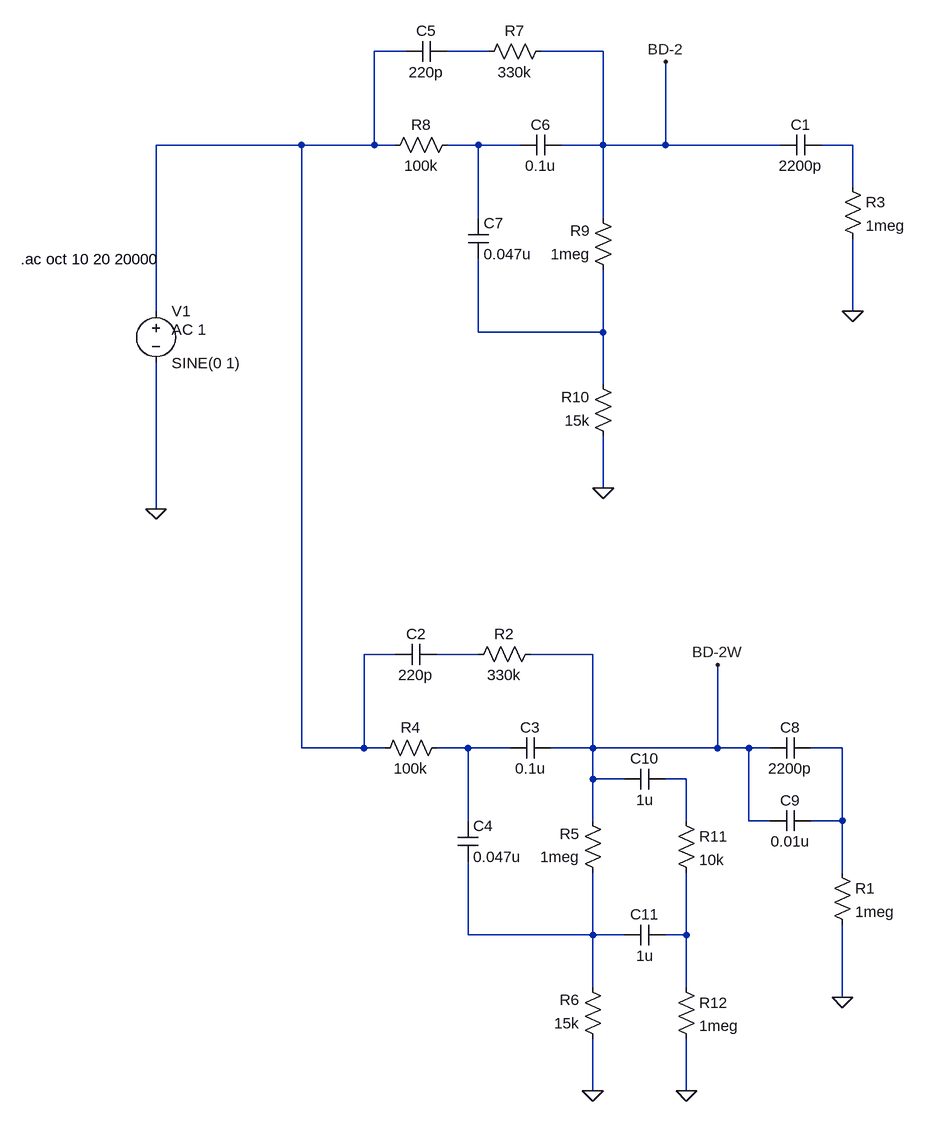
[diagram p0: schematic BD-2_BD-2W_PreClip.asc]
BD-2_BD-2W_PreClip.asc, the LTspice schematic file:
Version 4
SHEET 1 1244 1108
WIRE 464 -512 416 -512
WIRE 592 -512 528 -512
WIRE 768 -512 672 -512
WIRE 304 -368 80 -368
WIRE 416 -368 416 -512
WIRE 416 -368 304 -368
WIRE 448 -368 416 -368
WIRE 576 -368 528 -368
WIRE 640 -368 576 -368
WIRE 768 -368 768 -512
WIRE 768 -368 704 -368
WIRE 864 -368 864 -496
WIRE 864 -368 768 -368
WIRE 1040 -368 864 -368
WIRE 1152 -368 1104 -368
WIRE 1152 -304 1152 -368
WIRE 576 -256 576 -368
WIRE 768 -256 768 -368
WIRE 80 -112 80 -368
WIRE 1152 -112 1152 -224
WIRE 576 -80 576 -192
WIRE 768 -80 768 -176
WIRE 768 -80 576 -80
WIRE 768 0 768 -80
WIRE 768 160 768 80
WIRE 80 192 80 -32
WIRE 448 416 400 416
WIRE 576 416 512 416
WIRE 752 416 656 416
WIRE 304 560 304 -368
WIRE 400 560 400 416
WIRE 400 560 304 560
WIRE 432 560 400 560
WIRE 560 560 512 560
WIRE 624 560 560 560
WIRE 752 560 752 416
WIRE 752 560 688 560
WIRE 944 560 944 432
WIRE 944 560 752 560
WIRE 992 560 944 560
WIRE 1024 560 992 560
WIRE 1136 560 1088 560
WIRE 752 608 752 560
WIRE 800 608 752 608
WIRE 896 608 864 608
WIRE 560 672 560 560
WIRE 752 672 752 608
WIRE 896 672 896 608
WIRE 992 672 992 560
WIRE 1024 672 992 672
WIRE 1136 672 1136 560
WIRE 1136 672 1088 672
WIRE 1136 752 1136 672
WIRE 560 848 560 736
WIRE 752 848 752 752
WIRE 752 848 560 848
WIRE 800 848 752 848
WIRE 896 848 896 752
WIRE 896 848 864 848
WIRE 752 928 752 848
WIRE 896 928 896 848
WIRE 1136 944 1136 832
WIRE 752 1088 752 1008
WIRE 896 1088 896 1008
FLAG 80 192 0
FLAG 1152 -112 0
FLAG 768 160 0
FLAG 864 -496 BD-2
FLAG 1136 944 0
FLAG 752 1088 0
FLAG 944 432 BD-2W
FLAG 896 1088 0
SYMBOL res 1136 -320 R0
SYMATTR InstName R3
SYMATTR Value 1meg
SYMBOL voltage 80 -128 R0
WINDOW 123 24 44 Left 2
WINDOW 39 0 0 Left 2
SYMATTR Value2 AC 1
SYMATTR InstName V1
SYMATTR Value SINE(0 1)
SYMBOL cap 528 -528 R90
WINDOW 0 0 32 VBottom 2
WINDOW 3 32 32 VTop 2
SYMATTR InstName C5
SYMATTR Value 220p
SYMBOL cap 704 -384 R90
WINDOW 0 0 32 VBottom 2
WINDOW 3 32 32 VTop 2
SYMATTR InstName C6
SYMATTR Value 0.1u
SYMBOL res 688 -528 R90
WINDOW 0 0 56 VBottom 2
WINDOW 3 32 56 VTop 2
SYMATTR InstName R7
SYMATTR Value 330k
SYMBOL res 544 -384 R90
WINDOW 0 0 56 VBottom 2
WINDOW 3 32 56 VTop 2
SYMATTR InstName R8
SYMATTR Value 100k
SYMBOL res 784 -160 R180
WINDOW 0 36 76 Left 2
WINDOW 3 36 40 Left 2
SYMATTR InstName R9
SYMATTR Value 1meg
SYMBOL res 784 96 R180
WINDOW 0 36 76 Left 2
WINDOW 3 36 40 Left 2
SYMATTR InstName R10
SYMATTR Value 15k
SYMBOL cap 560 -256 R0
SYMATTR InstName C7
SYMATTR Value 0.047u
SYMBOL cap 1104 -384 R90
WINDOW 0 0 32 VBottom 2
WINDOW 3 32 32 VTop 2
SYMATTR InstName C1
SYMATTR Value 2200p
SYMBOL res 1120 736 R0
SYMATTR InstName R1
SYMATTR Value 1meg
SYMBOL cap 512 400 R90
WINDOW 0 0 32 VBottom 2
WINDOW 3 32 32 VTop 2
SYMATTR InstName C2
SYMATTR Value 220p
SYMBOL cap 688 544 R90
WINDOW 0 0 32 VBottom 2
WINDOW 3 32 32 VTop 2
SYMATTR InstName C3
SYMATTR Value 0.1u
SYMBOL res 672 400 R90
WINDOW 0 0 56 VBottom 2
WINDOW 3 32 56 VTop 2
SYMATTR InstName R2
SYMATTR Value 330k
SYMBOL res 528 544 R90
WINDOW 0 0 56 VBottom 2
WINDOW 3 32 56 VTop 2
SYMATTR InstName R4
SYMATTR Value 100k
SYMBOL res 768 768 R180
WINDOW 0 36 76 Left 2
WINDOW 3 36 40 Left 2
SYMATTR InstName R5
SYMATTR Value 1meg
SYMBOL res 768 1024 R180
WINDOW 0 36 76 Left 2
WINDOW 3 36 40 Left 2
SYMATTR InstName R6
SYMATTR Value 15k
SYMBOL cap 544 672 R0
SYMATTR InstName C4
SYMATTR Value 0.047u
SYMBOL cap 1088 544 R90
WINDOW 0 0 32 VBottom 2
WINDOW 3 32 32 VTop 2
SYMATTR InstName C8
SYMATTR Value 2200p
SYMBOL cap 1088 656 R90
WINDOW 0 0 32 VBottom 2
WINDOW 3 32 32 VTop 2
SYMATTR InstName C9
SYMATTR Value 0.01u
SYMBOL res 880 656 R0
SYMATTR InstName R11
SYMATTR Value 10k
SYMBOL cap 864 592 R90
WINDOW 0 0 32 VBottom 2
WINDOW 3 32 32 VTop 2
SYMATTR InstName C10
SYMATTR Value 1u
SYMBOL cap 864 832 R90
WINDOW 0 0 32 VBottom 2
WINDOW 3 32 32 VTop 2
SYMATTR InstName C11
SYMATTR Value 1u
SYMBOL res 880 912 R0
SYMATTR InstName R12
SYMATTR Value 1meg
TEXT -128 -192 Left 2 !.ac oct 10 20 20000

The netlist it stands for:
* BD-2_BD-2W_PreClip.asc
R3 N004 0 1meg
V1 N001 0 SINE(0 1) AC 1
C5 N002 N001 220p
C6 BD-2 N003 0.1u
R7 BD-2 N002 330k
R8 N003 N001 100k
R9 N005 BD-2 1meg
R10 0 N005 15k
C7 N003 N005 0.047u
C1 N004 BD-2 2200p
R1 N008 0 1meg
C2 N006 N001 220p
C3 BD-2W N007 0.1u
R2 BD-2W N006 330k
R4 N007 N001 100k
R5 N010 BD-2W 1meg
R6 0 N010 15k
C4 N007 N010 0.047u
C8 N008 BD-2W 2200p
C9 N008 BD-2W 0.01u
R11 N009 N011 10k
C10 N009 BD-2W 1u
C11 N011 N010 1u
R12 N011 0 1meg
.ac oct 10 20 20000
.backanno
.end